# EasyEDA Pro project Instrumentation Amplifier.eprj

# Schematic Amplifier
Create Date: 2023-09-21; Page Name: P1; Project Name: Instrumentation Amplifier; Schematic Name: Amplifier; Update Date: 2023-09-22; Company: Joshua; Drawed: Joshua; Page Size: A4; Part Number: JLCPCB-002; Reviewed: EasyEDA Pro; Version: V0.1
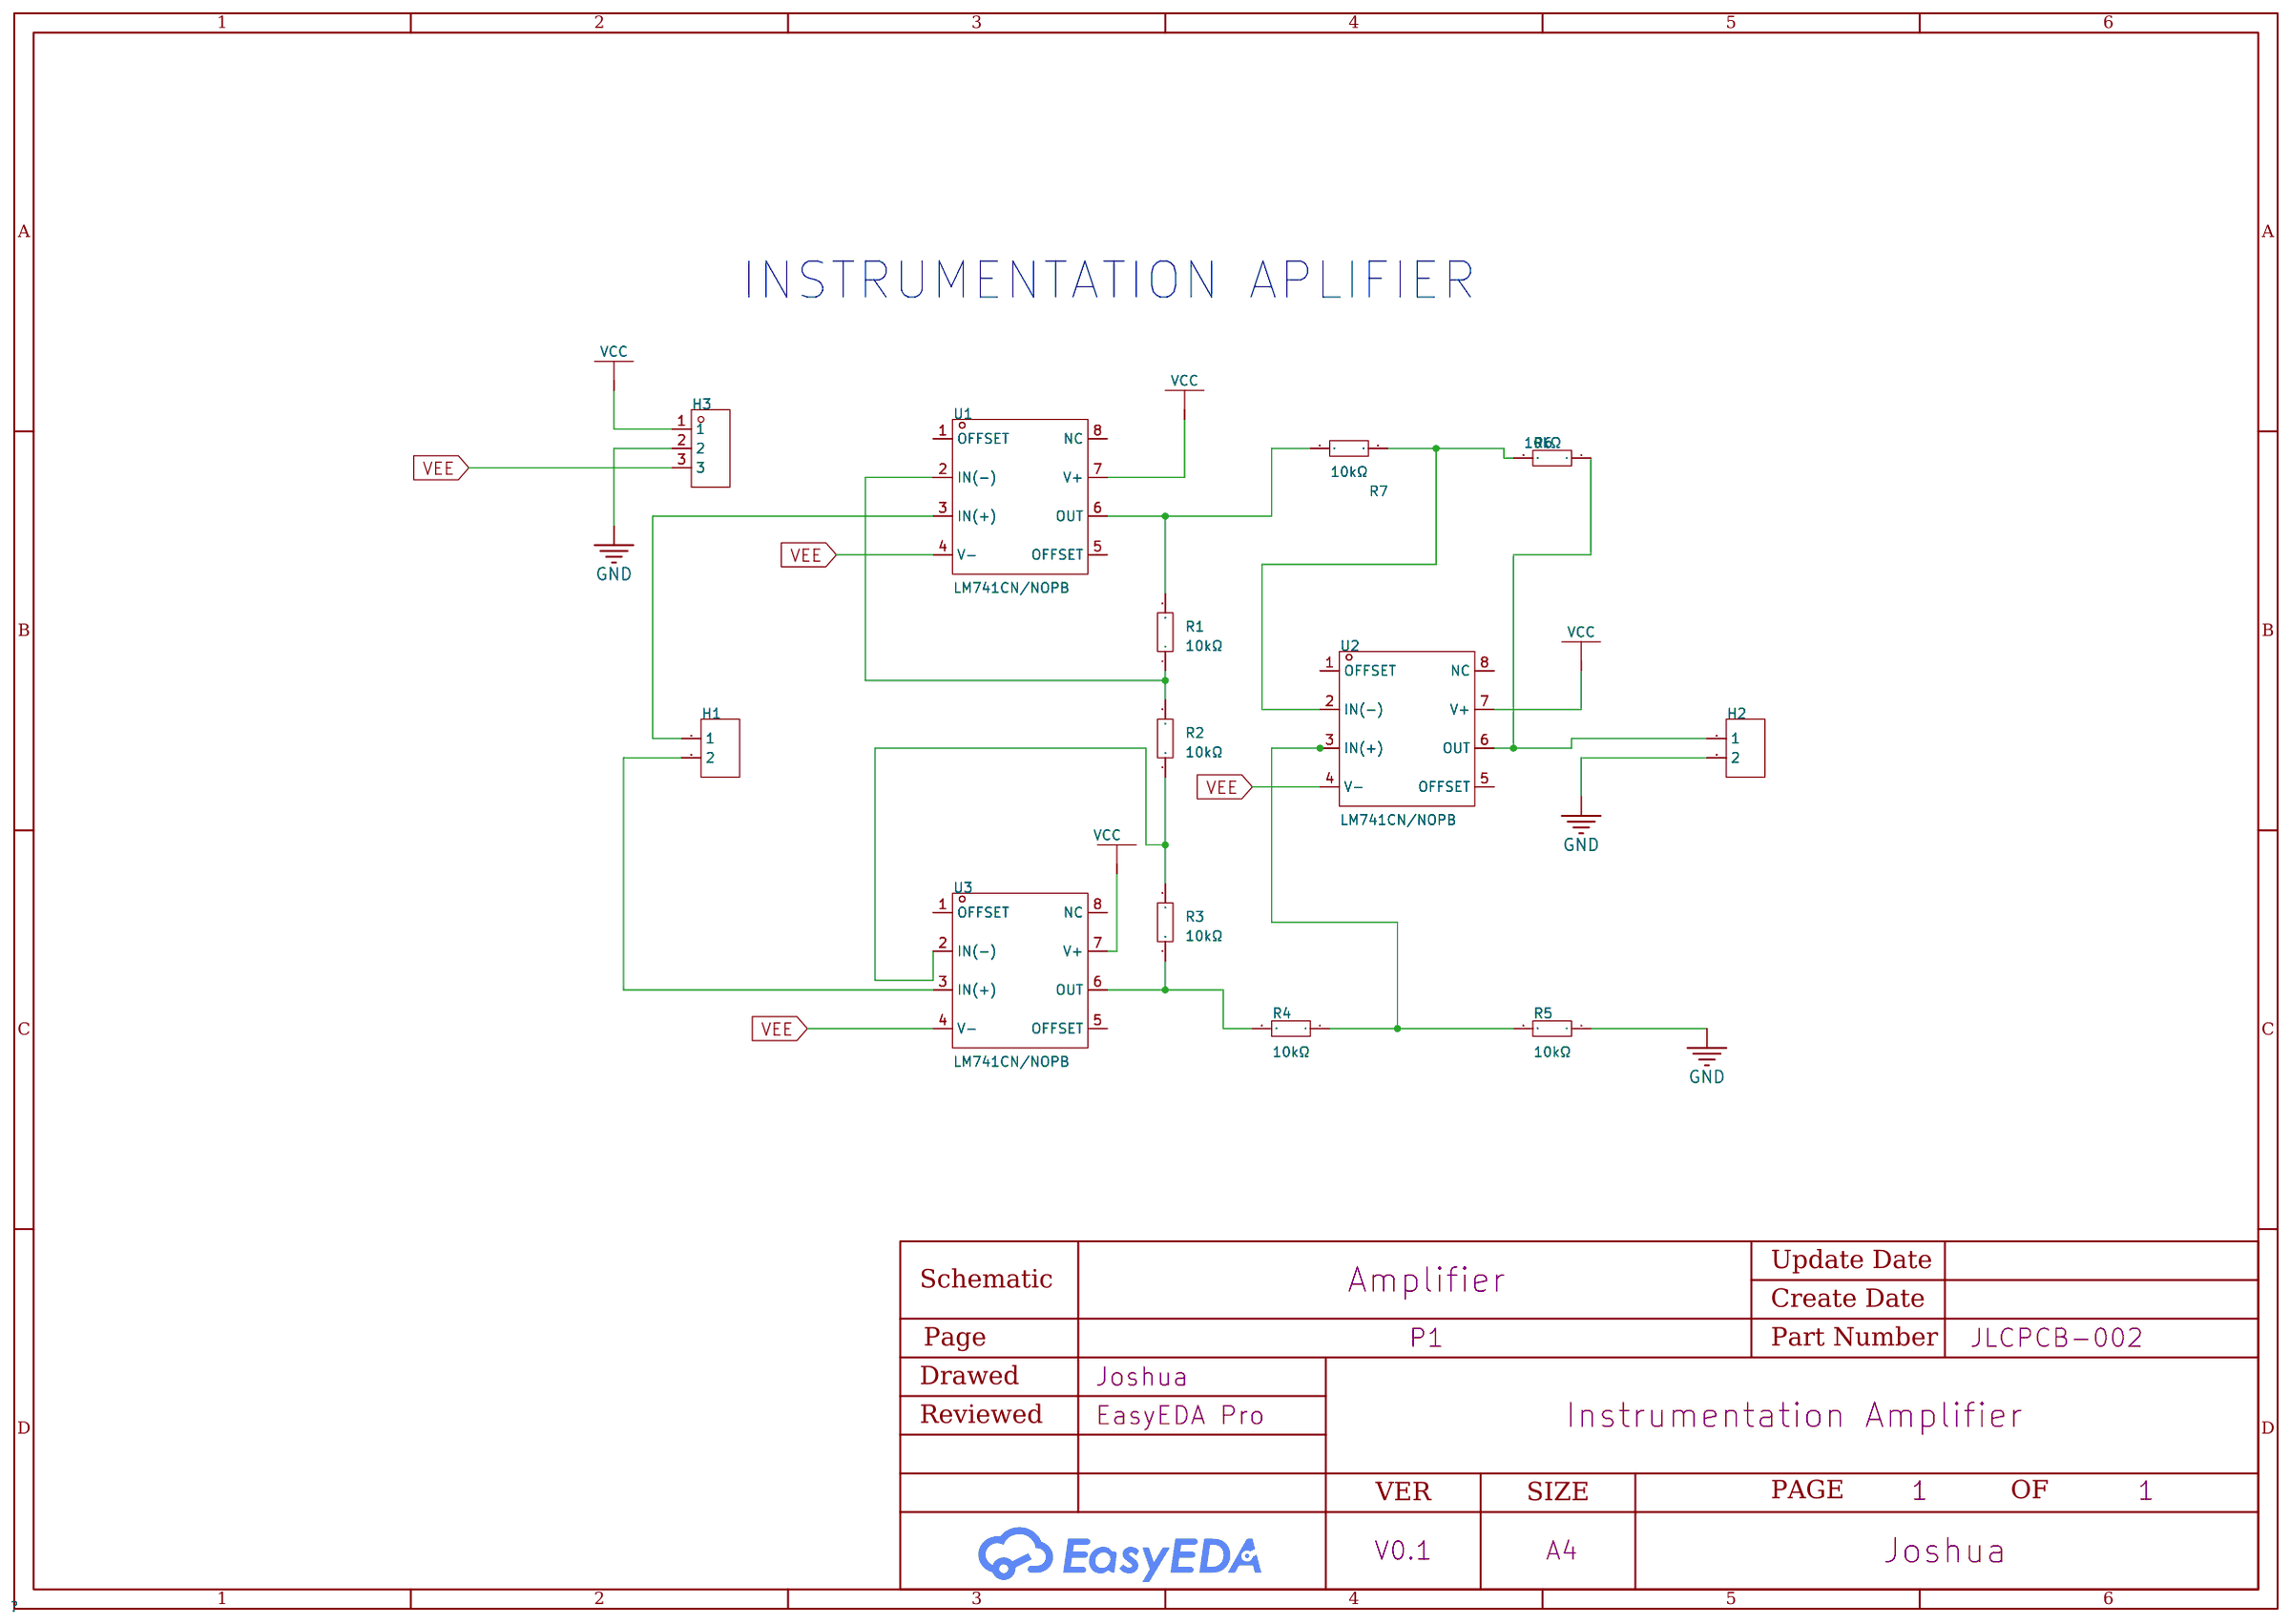
[diagram p0: schematic sheet]

## Parts
H1  -  [HDR-TH_2P-P2.54-V-F]
H2  -  [HDR-TH_2P-P2.54-V-F]
H3  -  [HDR-TH_3P-P2.54-V-F]
R1  10kΩ  [RES-TH_BD3.3-L9.0-P13.00-D0.6]
R2  10kΩ  [RES-TH_BD3.3-L9.0-P13.00-D0.6]
R3  10kΩ  [RES-TH_BD3.3-L9.0-P13.00-D0.6]
R4  10kΩ  [RES-TH_BD3.3-L9.0-P13.00-D0.6]
R5  10kΩ  [RES-TH_BD3.3-L9.0-P13.00-D0.6]
R6  10kΩ  [RES-TH_BD3.3-L9.0-P13.00-D0.6]
R7  10kΩ  [RES-TH_BD3.3-L9.0-P13.00-D0.6]
U1  LM741CN/NOPB  [DIP-8_L9.8-W6.6-P2.54-LS7.6-BL]
U2  LM741CN/NOPB  [DIP-8_L9.8-W6.6-P2.54-LS7.6-BL]
U3  LM741CN/NOPB  [DIP-8_L9.8-W6.6-P2.54-LS7.6-BL]

## Library data of the parts
H1 H2 = HDR-F_2.54_1x2P: Supplier Footprint: Through
H3 = HDR-F_2.54_1x3P: Supplier Footprint: Through
R1-R7 = Res_AXIAL-1/2W: Supplier Footprint: Through
U1-U3 = LM741CN/NOPB: Amplifier Type:General Purpose Number of Circuits: Gain Bandwidth Product（GBP）: Slew Rate（SR）: Output Type: Supply Voltage（Single）: Iq per channel (Typ): Operating Temperature:; Supplier Part: C13974; Manufacturer: TI(德州仪器); Supplier Footprint: DIP-8; JLCPCB Part Class: Extended Part; Datasheet: https://atta.szlcsc.com/upload/public/pdf/source/20130617/1457706610788.pdf; Supplier: LCSC; Amplifier Type: General Purpose

## Nets
GND: H2.2 H3.2 R5.1
VCC: H3.1 U1.7(V+) U2.7(V+) U3.7(V+)
VEE: H3.3 U1.4(V-) U2.4(V-) U3.4(V-)
$1N796: R3.1 R4.2 U3.6(OUT)
$1N867: R2.1 R3.2 U3.2(IN(-))
$1N904: R1.1 R2.2 U1.2(IN(-))
$1N921: H1.2 U3.3(IN(+))
$1N930: H1.1 U1.3(IN(+))
$1N940: R1.2 R7.2 U1.6(OUT)
$1N950: H2.1 R6.1 U2.6(OUT)
$1N971: R6.2 R7.1 U2.2(IN(-))
$1N997: R4.1 R5.2 U2.3(IN(+))

Not connected (* = marked no-connect by the designer): U1 1(OFFSET) 5(OFFSET) 8(NC); U2 1(OFFSET) 5(OFFSET) 8(NC); U3 1(OFFSET) 5(OFFSET) 8(NC)

## Notes on the sheet
- INSTRUMENTATION APLIFIER

# Board PCB1
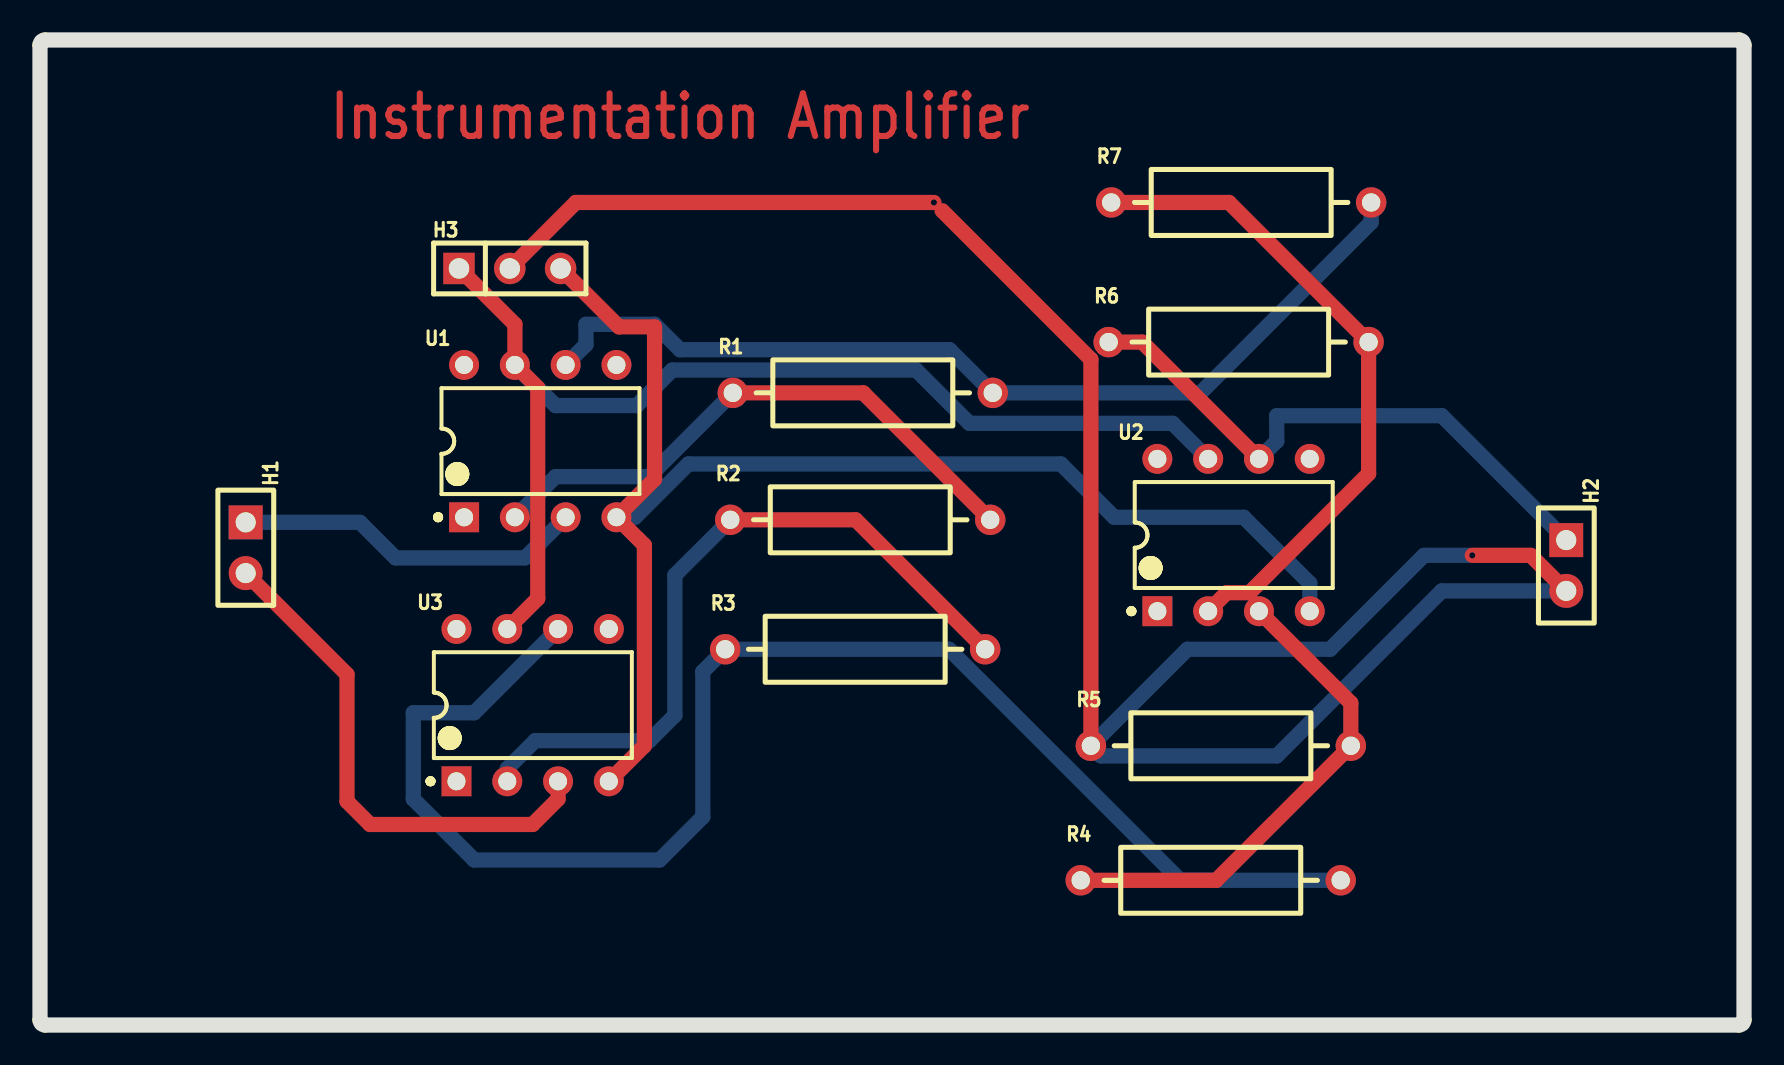
[diagram p1: board, top side]
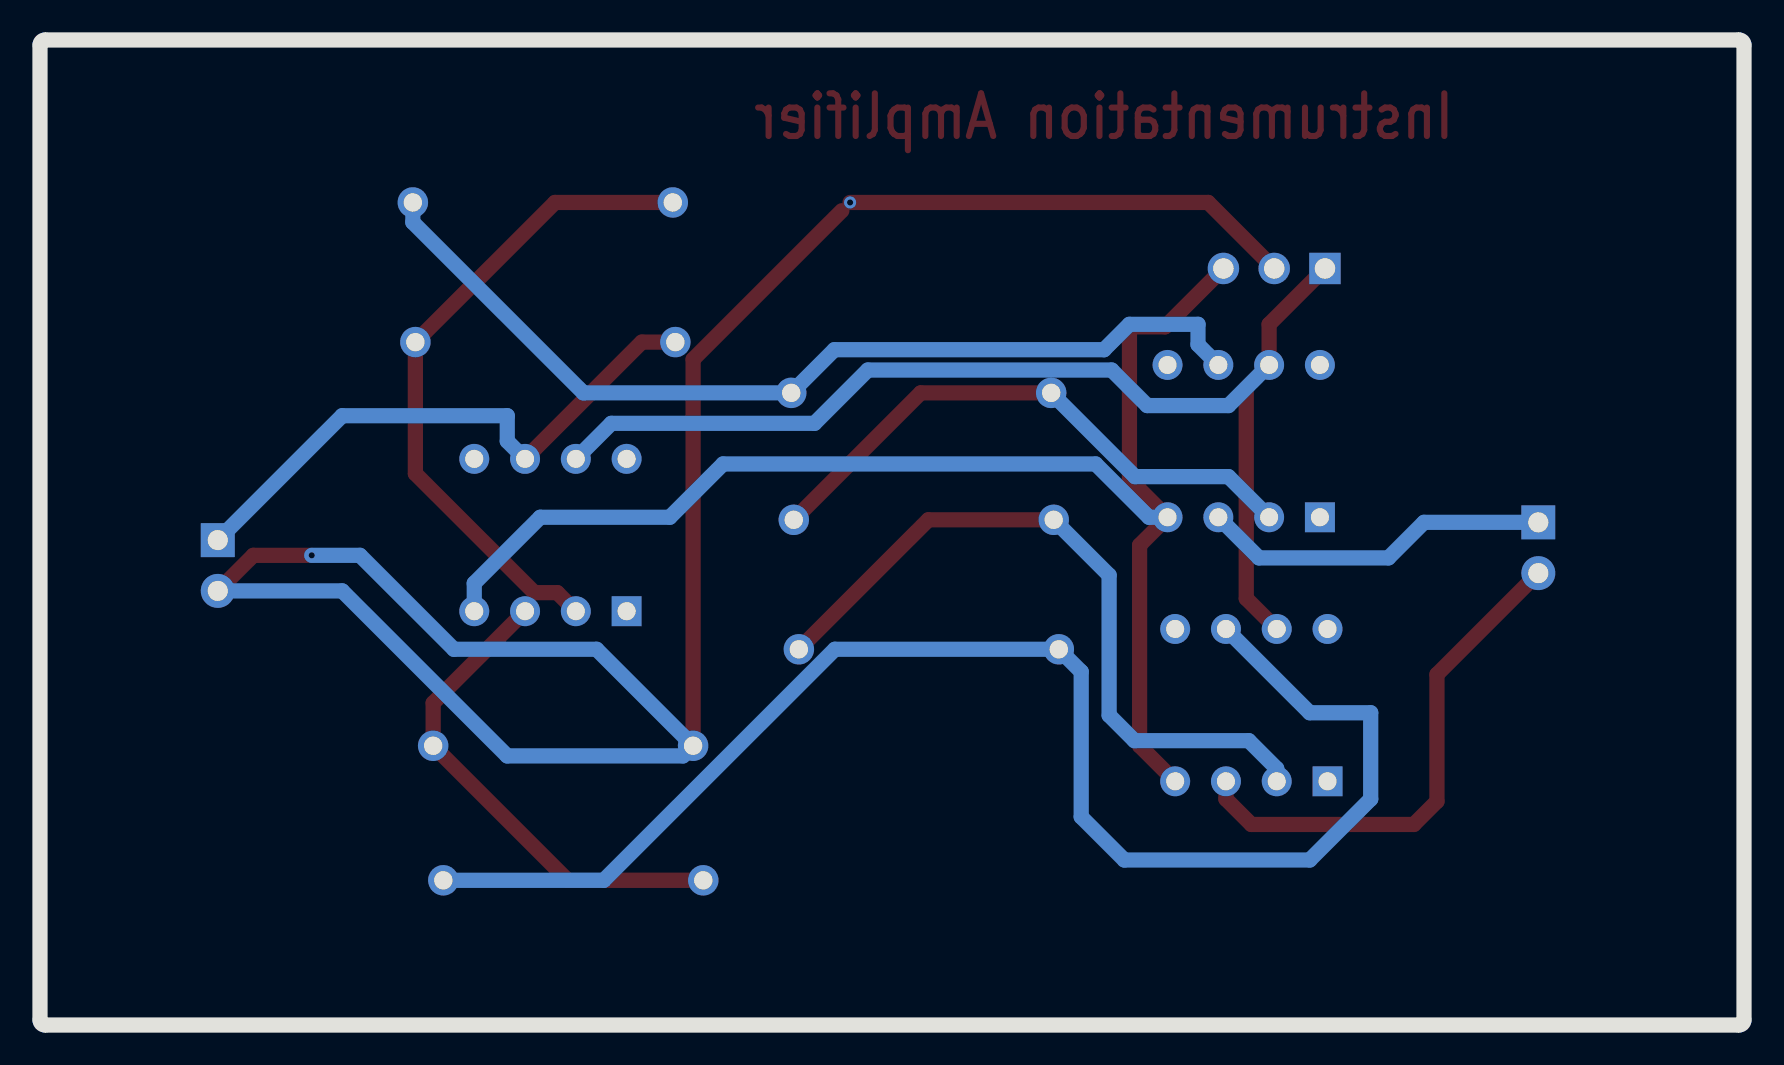
[diagram p2: board, bottom side, seen from below]

Outline 85.22 x 49.28 mm; copper layers: Top Layer, Bottom Layer. Coordinates in mm from the lower left corner of the outline.
Outline path: 0,49.02 0,0.25 arc(0.07,0.07) 0.25,0 84.96,0 arc(85.14,0.07) 85.22,0.25 85.22,49.02 arc(85.14,49.2) 84.96,49.28 0.25,49.28 arc(0.07,49.2) 0,49.02
Stack: Top Layer 0.035mm / Dielectric1 1.51mm FR4 er 4.5 / Bottom Layer 0.035mm

## Design rules (mm)
template: JLCPCB Capability(Two Layers Board)
spacing copperThickness1oz (default): track to track 0.102, other pairs 0.152 to 0.3
spacing copperThickness2oz: track to track 0.203, other pairs 0.152 to 0.3
track width copperThickness1oz (default): min 0.127, default 0.254, max 2.54
track width copperThickness2oz: min 0.203, default 0.254, max 2.54
differential pair differentialPair (default): width min 0.127, default 0.254, max 2.54; gap min 0.152, default 0.152
via viaSize (default): diameter min 0.5, default 0.61, max 10; hole min 0.3, default 0.305, max 6.3

## Placement (name value [footprint] x y rotation side)
H1  -  [HDR-TH_2P-P2.54-V-F]  10.29 23.88 270 top
H2  -  [HDR-TH_2P-P2.54-V-F]  76.33 22.99 270 top
H3  -  [HDR-TH_3P-P2.54-V-F]  23.5 37.85 0 top
R1  10kΩ  [RES-TH_BD3.3-L9.0-P13.00-D0.6]  41.15 31.62 0 top
R2  10kΩ  [RES-TH_BD3.3-L9.0-P13.00-D0.6]  41.02 25.27 0 top
R3  10kΩ  [RES-TH_BD3.3-L9.0-P13.00-D0.6]  40.77 18.8 0 top
R4  10kΩ  [RES-TH_BD3.3-L9.0-P13.00-D0.6]  58.55 7.24 0 top
R5  10kΩ  [RES-TH_BD3.3-L9.0-P13.00-D0.6]  59.06 13.97 0 top
R6  10kΩ  [RES-TH_BD3.3-L9.0-P13.00-D0.6]  59.94 34.16 0 top
R7  10kΩ  [RES-TH_BD3.3-L9.0-P13.00-D0.6]  60.07 41.15 0 top
U1  LM741CN/NOPB  [DIP-8_L9.8-W6.6-P2.54-LS7.6-BL]  25.02 29.21 0 top
U2  LM741CN/NOPB  [DIP-8_L9.8-W6.6-P2.54-LS7.6-BL]  59.69 24.51 0 top
U3  LM741CN/NOPB  [DIP-8_L9.8-W6.6-P2.54-LS7.6-BL]  24.64 16 0 top

## Footprints (pads in the part's own frame, mm; a bottom-side part is the same pattern mirrored in y, then rotated)
DIP-8_L9.8-W6.6-P2.54-LS7.6-BL
  rect 1.5x1.5 hole 0.9: 1(-3.81,-3.81)
  round 1.5 hole 0.9: 2(-1.27,-3.81) 3(1.27,-3.81) 4(3.81,-3.81) 5(3.81,3.81) 6(1.27,3.81) 7(-1.27,3.81) 8(-3.81,3.81)
HDR-TH_2P-P2.54-V-F
  rect 1.7x1.7 hole 1: 1(-1.27,0)
  round 1.7 hole 1: 2(1.27,0)
HDR-TH_3P-P2.54-V-F
  rect 1.575x1.575 hole 1.02: 1(-2.54,0)
  round 1.575 hole 1.02: 2(0,0) 3(2.54,0)
RES-TH_BD3.3-L9.0-P13.00-D0.6
  round 1.524 hole 0.914: 1(-6.5,0) 2(6.5,0)

## Nets
As in the schematic.

Pads without a net: U1 1 5 8; U2 1 5 8; U3 1 5 8

## Via types
v1: diameter 0.61, hole 0.305, Top Layer to Bottom Layer, 3 vias

## Routing (per net, layer and track width the routed paths; a pad name or vN(x,y) marks a point on that pad's centre or on a via; arc(x,y) is an arc through that point)
GND: length 80.3
  Top Layer w0.762: v1(44.7,41.15) 26.8,41.15 H3.2 ; v1(71.63,23.49) 74.55,23.49 H2.2 ; R5.1 52.56,33.3 45.12,40.73
  Bottom Layer w0.762: v1(71.63,23.49) 69.22,23.49 64.52,18.8 57.38,18.8 52.97,14.38
VCC: length 58.4
  Top Layer w0.762: U3.7 24.89,21.34 24.89,31.88 U1.7 23.75,35.05 H3.1
  Bottom Layer w0.762: 58.42,28.32 56.64,30.1 46.48,30.1 43.81,32.77 31.62,32.77 29.84,30.99 25.78,30.99 U1.7
VEE: length 70.4
  Top Layer w0.762: H3.3 28.96,34.92 30.73,34.92 30.73,27.3 U1.4 30.23,24 30.23,13.97 U3.4
  Bottom Layer w0.762: U2.4 63.5,22.1 60.2,25.4 53.72,25.4 51.05,28.07 32.42,28.07 29.76,25.4 U1.4
(no net): length 27.4
  Bottom Layer w0.762: v1(52.56,13.97) 53.06,13.46 61.85,13.46 70.1,21.72 76.33,21.72
$1N796: length 74.3
  Bottom Layer w0.762: R4.2 57.02,7.24 45.47,18.8 R3.1 33.15,17.68 33.15,10.41 30.99,8.25 21.72,8.25 18.67,11.3 18.67,15.62 21.72,15.62 U3.6
$1N867: length 36.5
  Top Layer w0.762: R3.2 40.79,25.27 R2.1
  Bottom Layer w0.762: R2.1 31.75,22.5 31.75,15.49 30.48,14.22 24.77,14.22 23.37,12.83 U3.2
$1N904: length 29
  Top Layer w0.762: R2.2 41.17,31.62 R1.1
  Bottom Layer w0.762: R1.1 30.46,27.43 25.78,27.43 U1.2
$1N921: length 26
  Top Layer w0.762: U3.3 25.91,11.3 24.64,10.03 16.51,10.03 15.36,11.19 15.36,17.54 H1.2
$1N930: length 17.6
  Bottom Layer w0.762: U1.3 24.26,23.37 17.78,23.37 16,25.15 10.29,25.15
$1N940: length 47.7
  Bottom Layer w0.762: R7.2 66.57,40.16 58.04,31.62 R1.2 45.49,33.78 32,33.78 30.73,35.05 27.31,35.05 27.31,34.04 U1.6
$1N950: length 29.5
  Top Layer w0.762: U2.6 55.12,34.16 R6.1
  Bottom Layer w0.762: H2.1 70.1,30.48 61.85,30.48 61.85,29.21 U2.6
$1N971: length 33.2
  Top Layer w0.762: R7.1 59.46,41.15 R6.2 66.44,27.58 60.49,21.63 59.35,21.63 58.42,20.7
$1N997: length 24.9
  Top Layer w0.762: U2.3 65.56,16.11 R5.2 58.82,7.24 R4.1

## Text on the board
Top Layer: Instrumentation Amplifier
